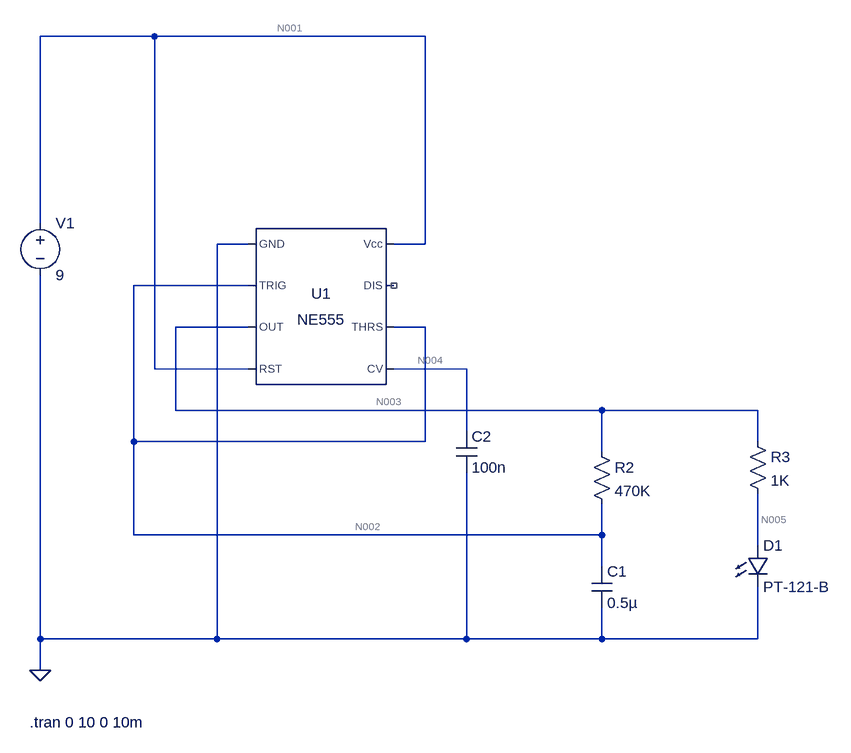
[diagram p0: schematic clock-1.asc]
clock-1.asc, the LTspice schematic file:
Version 4
SHEET 1 984 832
WIRE -64 -240 -240 -240
WIRE 352 -240 -64 -240
WIRE -240 48 -240 -240
WIRE 80 80 32 80
WIRE 352 80 352 -240
WIRE 352 80 304 80
WIRE 80 144 -96 144
WIRE 80 208 -32 208
WIRE 352 208 304 208
WIRE -64 272 -64 -240
WIRE 80 272 -64 272
WIRE 416 272 304 272
WIRE -32 336 -32 208
WIRE 624 336 -32 336
WIRE 864 336 624 336
WIRE 416 368 416 272
WIRE -96 384 -96 144
WIRE 352 384 352 208
WIRE 352 384 -96 384
WIRE 864 384 864 336
WIRE 624 400 624 336
WIRE -96 528 -96 384
WIRE 624 528 624 480
WIRE 624 528 -96 528
WIRE 864 544 864 464
WIRE 624 576 624 528
WIRE -240 688 -240 128
WIRE 32 688 32 80
WIRE 32 688 -240 688
WIRE 416 688 416 432
WIRE 416 688 32 688
WIRE 624 688 624 640
WIRE 624 688 416 688
WIRE 864 688 864 608
WIRE 864 688 624 688
WIRE -240 736 -240 688
FLAG -240 736 0
SYMBOL Misc\\NE555 192 176 R0
SYMATTR InstName U1
SYMBOL res 608 384 R0
SYMATTR InstName R2
SYMATTR Value 470K
SYMBOL res 848 368 R0
SYMATTR InstName R3
SYMATTR Value 1K
SYMBOL cap 608 576 R0
SYMATTR InstName C1
SYMATTR Value 0.5µ
SYMBOL LED 848 544 R0
SYMATTR InstName D1
SYMATTR Value PT-121-B
SYMBOL voltage -240 32 R0
WINDOW 123 0 0 Left 0
WINDOW 39 0 0 Left 0
SYMATTR InstName V1
SYMATTR Value 9
SYMBOL cap 400 368 R0
SYMATTR InstName C2
SYMATTR Value 100n
TEXT -256 816 Left 2 !.tran 0 10 0 10m

The netlist it stands for:
* clock-1.asc
XU1 0 N002 N003 N001 N004 N002 NC_01 N001 NE555  ; pins GND TRIG OUT RST CV THRS DIS Vcc
R2 N003 N002 470K
R3 N003 N005 1K
C1 N002 0 0.5µ
D1 N005 0 PT-121-B
V1 N001 0 9
C2 N004 0 100n
.model D D
.lib standard.dio
.tran 0 10 0 10m
.lib NE555.sub
.backanno
.end

* Results of the author's LTspice run, read from the files saved beside the schematic
* Operating Point, zero values left out:
*   V(n002) = 8.95 V
*   V(n004) = 6 V
*   V(n001) = 9 V
*   V(n003) = 8.959 V
*   V(n005) = 2.093 V
*   I(D1) = 6.866 mA
*   I(R3) = 6.866 mA
*   I(R2) = 17.9 nA
*   I(V1) = -9.774 mA
*   Ix(u1:1) = -2.908 mA
*   Ix(u1:2) = 8.95 nA
*   Ix(u1:3) = -6.866 mA
*   Ix(u1:4) = 49.33 µA
*   Ix(u1:6) = 8.95 nA
*   Ix(u1:8) = 9.725 mA
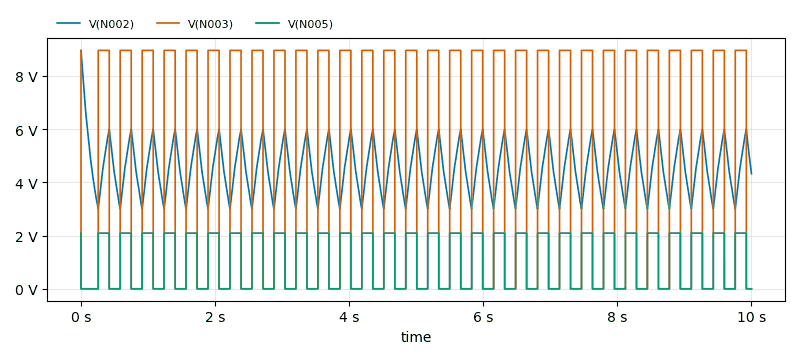
[diagram p1: Transient Analysis of clock-1.asc, plotted from the saved traces]
* Transient Analysis, 1 run:
*   V(N002): min 2.999 V, max 8.95 V, average 4.536 V, rms 4.66 V, last 4.323 V
*   V(N003): min 92.28 µV, max 8.959 V, average 4.429 V, rms 6.299 V, last 109.2 µV
*   V(N005): min 92.1 µV, max 2.094 V, average 1.035 V, rms 1.472 V, last 109 µV